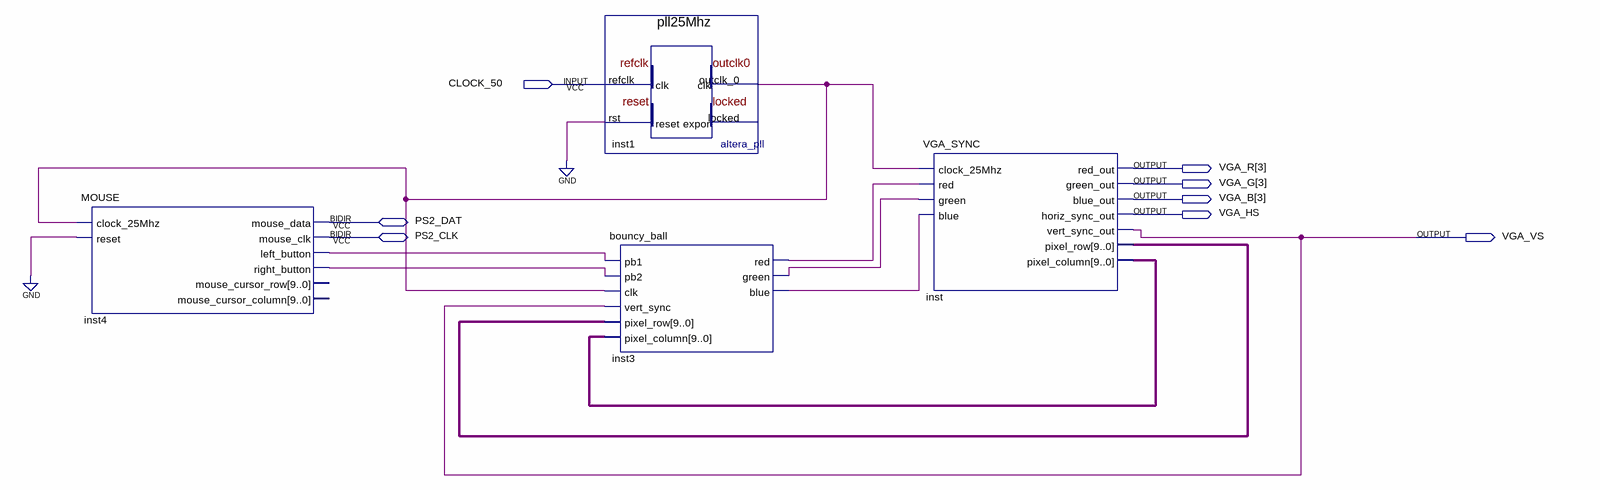
[diagram p0: schematic sheet]
// Quartus schematic vga_tester.bdf as structural Verilog: 4 symbols, 8 pins
module vga_tester (
  input  CLOCK_50,
  inout  PS2_DAT,
  inout  PS2_CLK,
  output [3:3] VGA_R,
  output [3:3] VGA_G,
  output [3:3] VGA_B,
  output VGA_HS,
  output VGA_VS
);

  wire inst1_outclk_0, inst3_blue, inst3_green, inst3_red, inst4_left_button, inst4_right_button;
  wire [9:0] inst_pixel_column, inst_pixel_row;

  MOUSE inst4 (
    .clock_25Mhz(inst1_outclk_0), .reset(1'b0), .left_button(inst4_left_button),
    .right_button(inst4_right_button), .mouse_data(PS2_DAT), .mouse_clk(PS2_CLK));  // open: mouse_cursor_row, mouse_cursor_column
  pll25Mhz inst1 (.refclk(CLOCK_50), .rst(1'b0), .outclk_0(inst1_outclk_0));  // open: locked
  bouncy_ball inst3 (
    .pb1(inst4_left_button), .pb2(inst4_right_button), .clk(inst1_outclk_0), .vert_sync(VGA_VS),
    .pixel_row(inst_pixel_row), .pixel_column(inst_pixel_column), .red(inst3_red), .green(inst3_green),
    .blue(inst3_blue));
  VGA_SYNC inst (
    .clock_25Mhz(inst1_outclk_0), .red(inst3_red), .green(inst3_green), .blue(inst3_blue),
    .red_out(VGA_R[3]), .green_out(VGA_G[3]), .blue_out(VGA_B[3]), .horiz_sync_out(VGA_HS),
    .vert_sync_out(VGA_VS), .pixel_row(inst_pixel_row), .pixel_column(inst_pixel_column));
endmodule
